# EAGLE design EspDetElet (EAGLE 6.4)
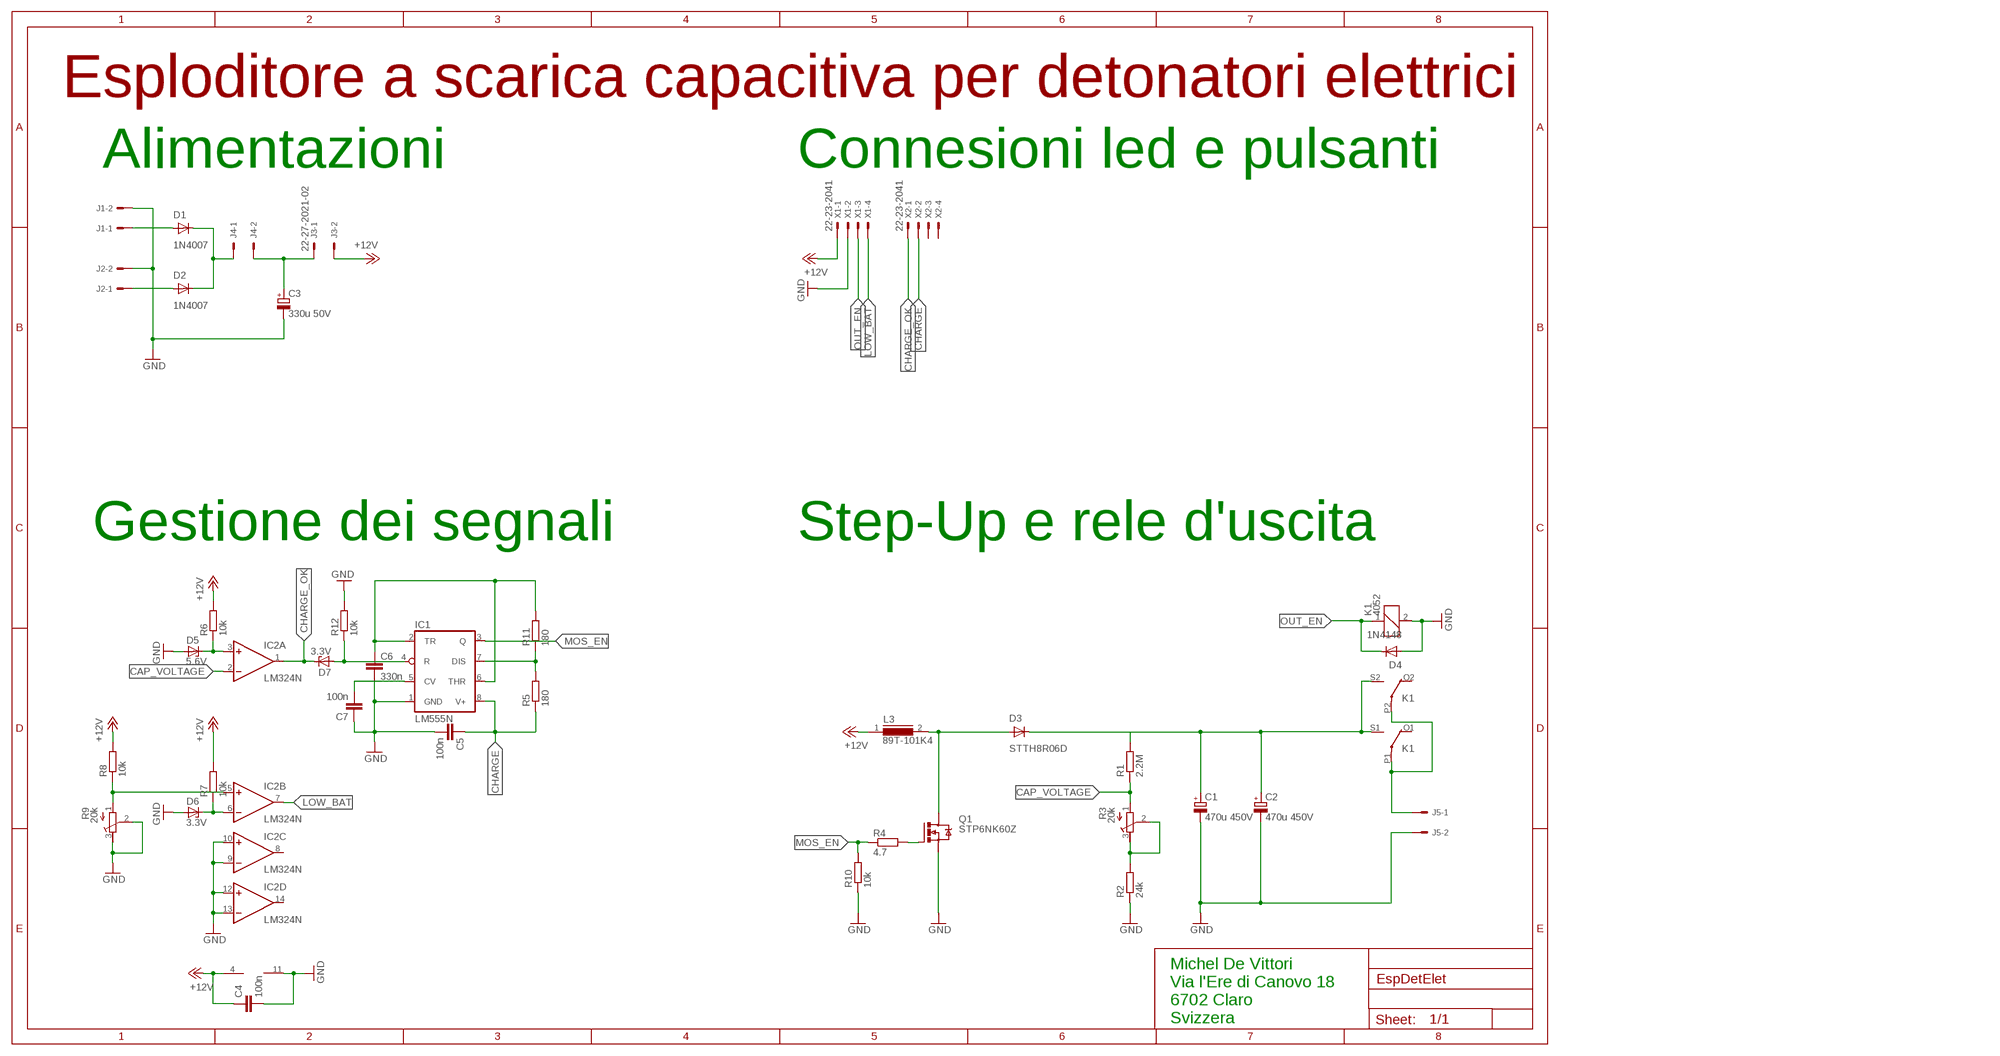
[diagram p0: schematic, sheet 1]

## Parts
C1  470u 450V  CPOL-EUE10-30  [EB30D]
C2  470u 450V  CPOL-EUE10-30  [EB30D]
C3  330u 50V  CPOL-EUE5-10.5  [E5-10,5]
C4  100n  C-EU025-025X050  [C025-025X050]
C5  100n  C-EU025-025X050  [C025-025X050]
C6  330n  C-EU050-030X075  [C050-030X075]
C7  100n  C-EU025-025X050  [C025-025X050]
D1  1N4007  1N4004  [DO41-10]
D2  1N4007  1N4004  [DO41-10]
D3  STTH8R06D  BYT08P  [TO220ACS]
D4  1N4148  1N4148DO35-7  [DO35-7]
D5  5.6V  ZENER-DIODEZD-7.5  [ZDIO-7.5]
D6  3.3V  ZENER-DIODEZD-7.5  [ZDIO-7.5]
D7  3.3V  ZENER-DIODEZD-7.5  [ZDIO-7.5]
IC1  LM555N  [DIL08]
IC2  LM324N  [DIL14]
J1  KK-156-2  [KK-156-2]
J2  KK-156-2  [KK-156-2]
J3  22-27-2021-02  [6410-02]
J4  KK-156-2  [KK-156-2]
J5  KK-156-2  [KK-156-2]
K1  4052  [F4052]
L3  89T-101K4  SFT1030  [SFT1030]
Q1  STP6NK60Z  STP5NA50  [TO220BV]
R1  2.2M  R-EU_0207/10  [0207/10]
R2  24k  R-EU_0207/10  [0207/10]
R3  20k  R-TRIMM64W  [RTRIM64W]
R4  4.7  R-EU_0207/10  [0207/10]
R5  180  R-EU_0207/10  [0207/10]
R6  10k  R-EU_0207/10  [0207/10]
R7  10k  R-EU_0207/10  [0207/10]
R8  10k  R-EU_0207/10  [0207/10]
R9  20k  R-TRIMM64W  [RTRIM64W]
R10  10k  R-EU_0207/10  [0207/10]
R11  180  R-EU_0207/10  [0207/10]
R12  10k  R-EU_0207/10  [0207/10]
X1  22-23-2041  [22-23-2041]
X2  22-23-2041  [22-23-2041]

## Nets
+12V: C4.1 IC2.4(P:V+) J3.2 L3.1 R6.2 R7.2 R8.2 X1.1
CAP_VOLTAGE: IC2.2(A:-IN) R1.1 R3.1(E)
CHARGE: C5.1 IC1.8(V+) R5.1 X2.2
CHARGE_OK: D7.C IC2.1(A:OUT) X2.1
GND: C1.- C2.- C3.- C4.2 C5.2 C6.2 C7.1 D4.A D5.A D6.A IC1.1(GND) IC2.9(C:-IN) IC2.10(C:+IN) IC2.11(P:V-) IC2.12(D:+IN) IC2.13(D:-IN) J1.2 J2.2 J5.2 K1.2 Q1.S R2.1 R9.2(S) R9.3(A) R10.1 R12.2 X1.2
LOW_BAT: IC2.7(B:OUT) X1.4
MOS_EN: IC1.3(Q) R4.1 R10.2
N$1: C1.+ C2.+ D3.C K1.S1(2:S) K1.S2(3:S) R1.2
N$2: D1.A J1.1
N$3: D2.A J2.1
N$4: D1.C D2.C J4.1
N$5: D3.A L3.2 Q1.D
N$6: R2.2 R3.2(S) R3.3(A)
N$7: C3.+ J3.1 J4.2
N$8: Q1.G R4.2
N$9: IC1.7(DIS) R5.2 R11.1
N$10: C6.1 IC1.2(TR) IC1.6(THR) R11.2
N$11: C7.2 IC1.5(CV)
N$12: D5.C IC2.3(A:+IN) R6.1
N$13: D7.A IC1.4(R) R12.1
N$14: J5.1 K1.P1(2:P) K1.P2(3:P)
N$15: D6.C IC2.6(B:-IN) R7.1
N$16: IC2.5(B:+IN) R8.1 R9.1(E)
OUT_EN: D4.C K1.1 X1.3
Unconnected: IC2.8(C:OUT) IC2.14(D:OUT) K1.O1(2:O) K1.O2(3:O) X2.3 X2.4

## Notes on the sheet
- Esploditore a scarica capacitiva per detonatori elettrici
- Alimentazioni | Connesioni led e pulsanti
- Gestione dei segnali | Step-Up e rele d'uscita
- Michel De Vittori
  Via l'Ere di Canovo 18
  6702 Claro
  Svizzera

## Library data of the parts
C1-C3 = resistor:CPOL-EU: POLARIZED CAPACITOR, European symbol
C4-C7 = resistor:C-EU: CAPACITOR, European symbol
D1 D2 = diode:1N4004: DIODE general purpose rectifier, 1 A
D3 = diode:BYT08P: DIODE ultra fast
D4 = diode:1N4148: DIODE high speed (Philips)
D5-D7 = diode:ZENER-DIODE: Z-Diode
IC1 = linear:*555: TIMER
IC2 = linear:LM324: OP AMP
J1 J2 J4 J5 = con-molex:KK-156-2: KK 156 HEADER Source: http://www.molex.com/pdm_docs/sd/026604100_sd.pdf; OC_FARNELL: unknown; OC_NEWARK: unknown
J3 = con-molex:22-?-02: CONNECTOR wire to board 2.54 mm (.1 inch) pitch header; OC_FARNELL: unknown; OC_NEWARK: unknown
K1 = relay:4052: RELAY 2 x switch, Finder; OC_FARNELL: unknown; OC_NEWARK: unknown
L3 = inductors:SFT1030: INDUCTOR
Q1 = transistor-power:STP5NA50: N-CHANNEL MOS FET
R1 R2 R4-R8 R10-R12 = resistor:R-EU_: RESISTOR, European symbol
R3 R9 = resistor:R-TRIMM: Trimm resistor
X1 X2 = con-molex:22-23-2041: .100" (2.54mm) Center Header - 4 Pin; MF: MOLEX; MPN: 22-23-2041; OC_FARNELL: 1462920; OC_NEWARK: 38C0355

## Board
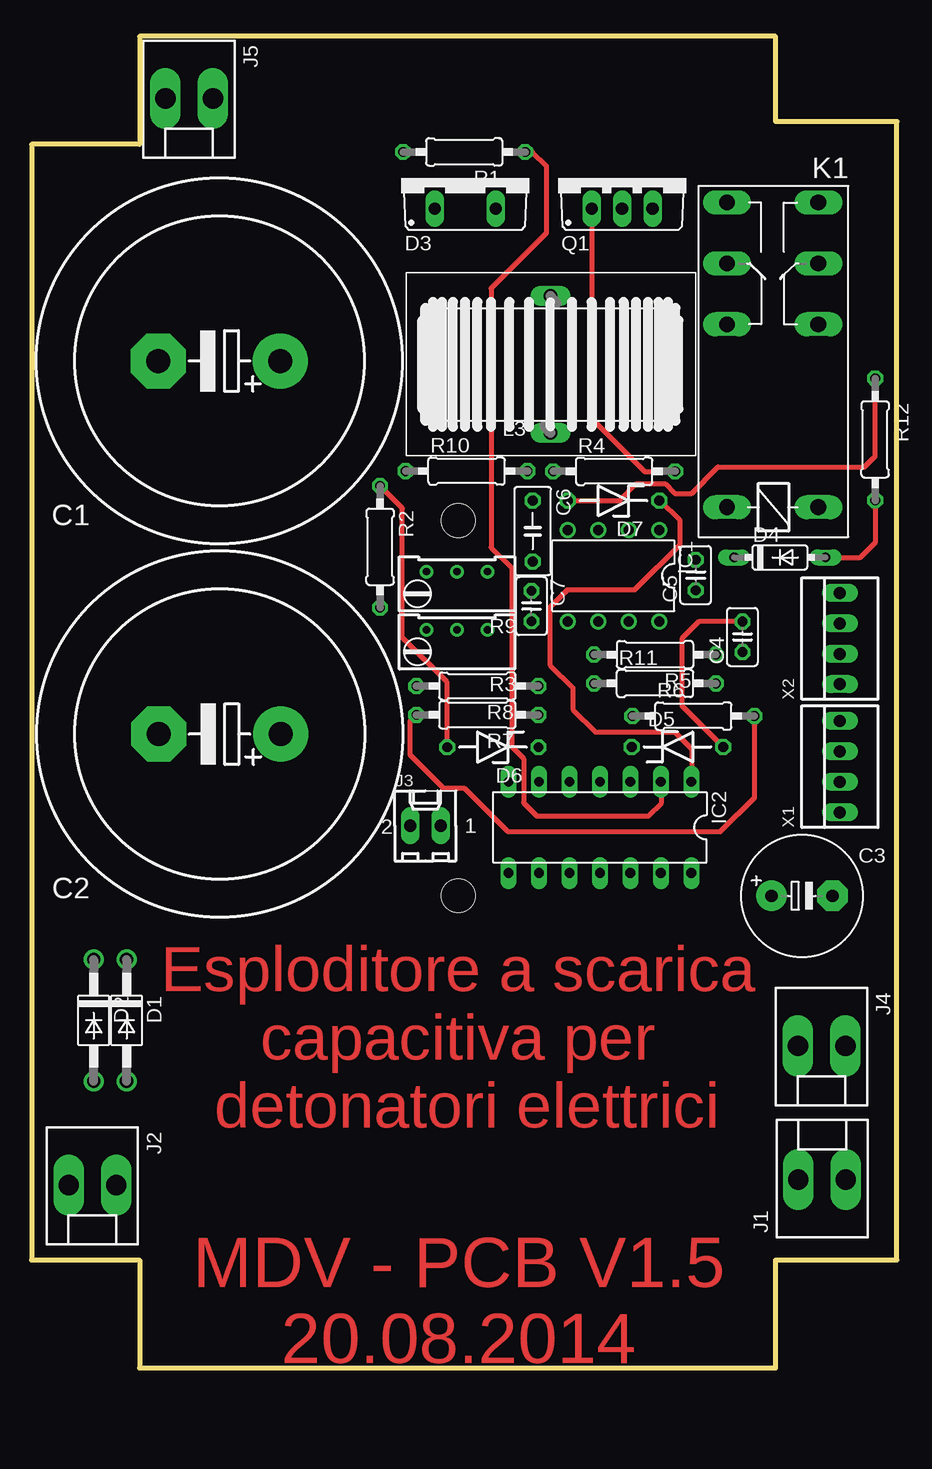
[diagram p1: board, top side]
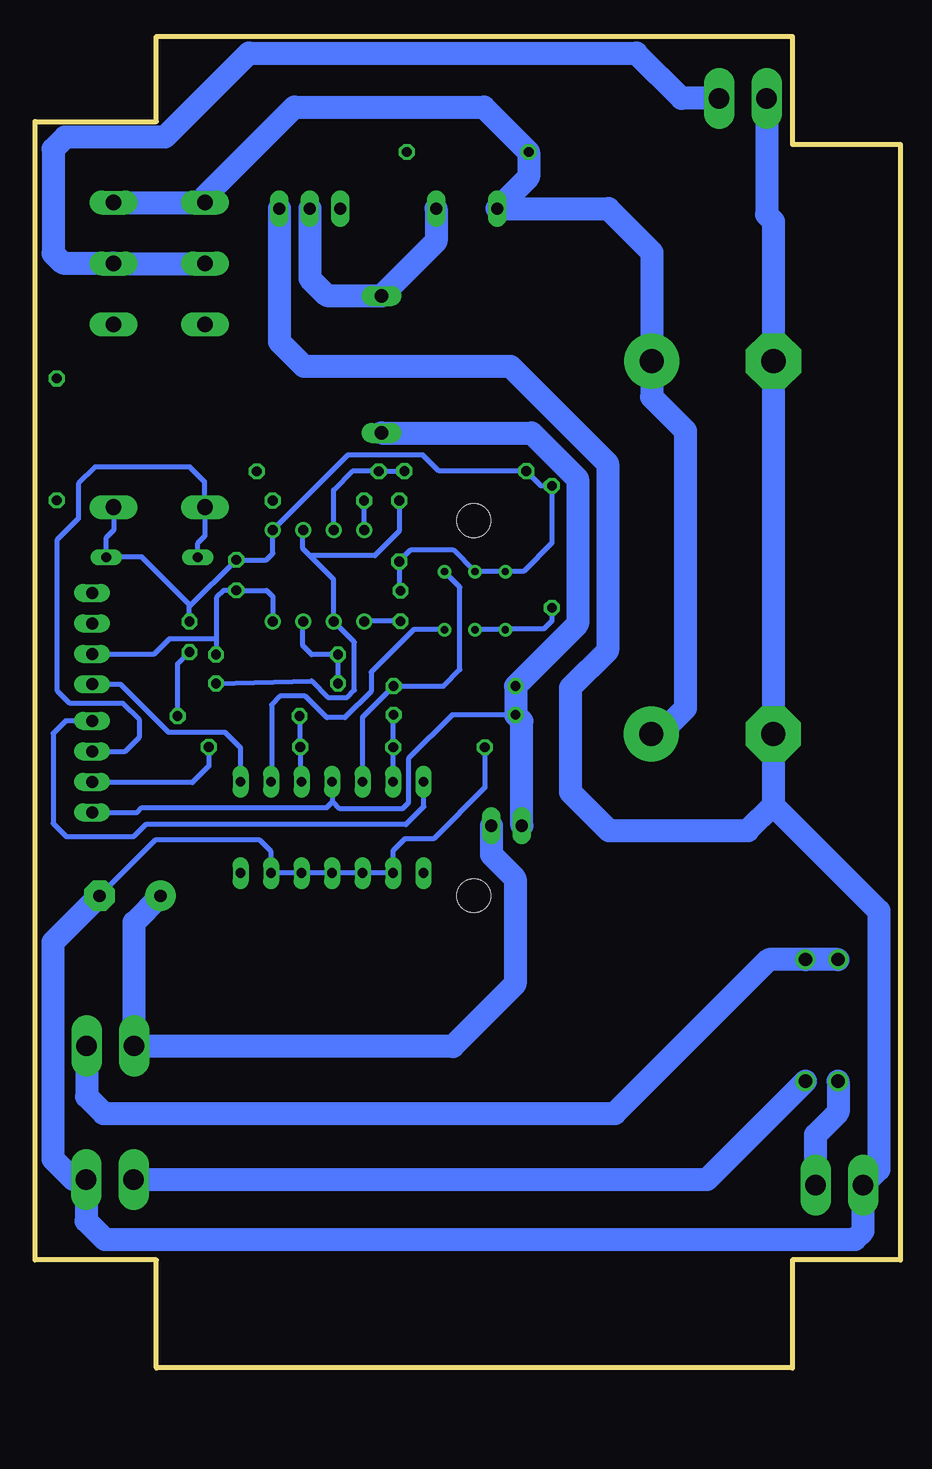
[diagram p2: board, bottom side, seen from below]

Size 72.1 x 111 mm. Coordinates in mm from the lower left corner, seen from the top.
Outline: 9,102 0,102 0,9 9,9 9,0 62,0 62,9 72.1,9 72.1,103.9 62,103.9 62,111 9,111 9,102
Copper layers (1*16): Top 0.035mm / dielectric 1.5mm / Bottom 0.035mm
Design rules "default": minimum track width 10mil, minimum drill 24mil, track to track 8mil, track to pad 8mil, pad to pad 8mil, via to via 8mil, smd to smd 8mil, copper to edge 40mil, drill to drill 8mil, minimum pad ring 10mil, minimum via ring 8mil, stop-mask expansion 4mil, vias tented up to drill 0mil, thermal gap 10mil
Holes 2.8 mm at 35.56,39.37 35.56,70.63
vRestrict: area 11.2,0 to 59.7,17.5; area 11.2,17.8 to 59.7,35.3

### Footprints (pad centres in the part's own frame; a part is rotated, then mirrored left to right if it is on the bottom)
EB30D = drill 2.007 pad 4.597: + -5.08,0 | drill 2.007 pad 4.597 octagon: - 5.08,0
E5-10,5 = drill 1.016 pad 2.54: + -2.54,0 | drill 1.016 pad 2.54 octagon: - 2.54,0
C025-025X050 = drill 0.813 octagon: 1 -1.27,0; 2 1.27,0
C050-030X075 = drill 0.813 octagon: 1 -2.54,0; 2 2.54,0
DO41-10 = drill 1.118: A 5.08,0; C -5.08,0
TO220ACS = drill 1.016 long: A 2.54,-2.54; C -2.54,-2.54
DO35-7 = drill 0.813 long: A 3.81,0; C -3.81,0
ZDIO-7.5 = drill 0.813 octagon: A 3.81,0; C -3.81,0
DIL08 = drill 0.813 pad 1.27: 1 -3.81,-3.81; 2 -1.27,-3.81; 3 1.27,-3.81; 4 3.81,-3.81; 5 3.81,3.81; 6 1.27,3.81; 7 -1.27,3.81; 8 -3.81,3.81
DIL14 = drill 0.813 long: 1 -7.62,-3.81; 2 -5.08,-3.81; 3 -2.54,-3.81; 4 0,-3.81; 5 2.54,-3.81; 6 5.08,-3.81; 7 7.62,-3.81; 8 7.62,3.81; 9 5.08,3.81; 10 2.54,3.81; 11 0,3.81; 12 -2.54,3.81; 13 -5.08,3.81; 14 -7.62,3.81
KK-156-2 = drill 1.7 pad 2.184 long: 1 -1.98,0; 2 1.98,0
6410-02 = drill 1.016 long: 1 1.27,0; 2 -1.27,0
F4052 = drill 1.321 long: 1 -3.81,3.81; 2 -3.81,-3.81; O1 11.43,-3.81; O2 11.43,3.81; P1 16.51,-3.81; P2 16.51,3.81; S1 21.59,-3.81; S2 21.59,3.81
SFT1030 = drill 1.118 long: 1 -5.75,-0.6; 2 5.68,-0.6
TO220BV = drill 1.016 long: D 0,-2.54; G -2.54,-2.54; S 2.54,-2.54
0207/10 = drill 0.813 octagon: 1 -5.08,0; 2 5.08,0
RTRIM64W = drill 0.61: 1 1.27,-2.54; 2 1.27,0; 3 1.27,2.54
22-23-2041 = drill 1 long: 1 -3.81,0; 2 -1.27,0; 3 1.27,0; 4 3.81,0

### Placement (x,y rotation side)
C1  15.65,83.94 180 top
C2  15.68,52.84 180 top
C3  64.2,39.35 0 top
C4  59.24,60.94 90 top
C5  55.34,66.09 90 top
C6  41.76,69.76 270 top
C7  41.66,63.51 270 top
D1  7.92,28.97 270 top
D2  5.18,28.97 270 top
D3  36.14,99.18 0 top
D4  62.36,67.57 0 top
D5  53.82,51.76 0 top
D6  38.44,51.74 180 top
D7  48.5,72.3 180 top
IC1  48.49,66.03 180 top
IC2  47.36,45.06 180 top
J1  65.87,15.71 0 top
J2  5.08,15.24 180 top
J3  32.82,45.19 0 top
J4  65.84,26.84 180 top
J5  13.13,105.83 180 top
K1  61.76,75.56 90 top
L3  42.64,83.68 90 top
Q1  49.21,99.18 0 top
R1  36.05,101.36 180 top
R2  29.04,68.45 270 top
R3  35.46,60.27 90 top
R4  48.55,74.74 0 top
R5  51.95,59.46 180 top
R6  55.15,54.34 0 top
R7  37.15,54.44 180 top
R8  37.15,56.84 180 top
R9  35.46,65.11 90 top
R10  36.25,74.76 0 top
R11  51.95,57.06 0 top
R12  70.3,77.4 270 top
X1  67.36,50.13 90 top
X2  67.36,60.8 90 top

### Tracks (layer width: path | path; a pad name or v marks a point on that pad's centre or on a via)
+12V
  Top 0.406: R6.2 60.23,47.53 57.4,44.7 39.7,44.7 36.1,48.3 34.35,48.3 31.55,51.1 31.55,53.92 R7.2
  Bottom 0.406: R6.2 60.23,58.68 C4.1 | X1.1 63.58,46.32 63.2,46.7 47.8,46.7 47.3,47.2 | 47.3,47.2 47.3,48.81 IC2.4 | R7.2 37.36,54.44 41,50.8 41,47.1 41.5,46.6 46.7,46.6 47.3,47.2
  Bottom 1.93: L3.1 30.73,77.93 26.9,74.1 26.9,62.01 R8.2 R7.2 31.55,53.92 J3.2
CAP_VOLTAGE
  Top 0.406: R1.1 41.74,101.36 42.9,100.2 42.9,94.6 38.3,90 38.3,68.4 40,66.7 40,51.8 41,50.8 41,47.1 42.1,46 51.4,46 52.5,47.1 52.5,48.81 IC2.2
  Bottom 0.406: R3.1 40.56,61.54 44.1,58 44.1,56.4 46.3,54.2 47.8,54.2 49.6,56 51.7,56 52.4,55.3 52.4,48.91 IC2.2
CHARGE
  Bottom 0.406: IC1.8 52.3,64.3 52.82,64.82 C5.1 56.38,64.82 57,64.2 57,60.9 | 57,60.9 57,59.93 R5.1 | X2.2 62.17,59.53 60.9,60.8 57.1,60.8 57,60.9
CHARGE_OK
  Top 0.406: IC2.1 55,48.89 55,51.6 53.6,53 47,53 45.1,54.9 45.1,56.7 43.2,58.6 43.2,63.4 44.68,64.88 50.28,64.88 54,68.6 54,70.7 52.4,72.3 D7.C
  Bottom 0.406: X2.1 64.99,56.99 61,53 56.3,53 55,51.7 55,48.89 IC2.1
GND
  Top 0.406: D5.A 54.2,55.2 54.2,60.8 55.61,62.21 C4.2 | D6.A 34.63,57.17 30.9,60.9 30.9,71.67 R2.1 | R12.2 70.3,68.8 69.07,67.57 D4.A
  Bottom 0.406: K1.2 65.57,69.83 66.17,69.23 D4.A 66.14,67.6 63.2,67.6 59.24,63.64 C4.2 59.24,63.46 C5.2 52.84,67.36 52.3,67.9 IC1.1 46.04,76.1 39.8,76.1 38.46,74.76 R10.1 29.94,73.53 R2.1 29.04,68.76 31.4,66.4 32.9,66.4 R9.3 R9.2 37.28,68.2 40.8,68.2 41.76,67.24 C6.2 41.76,64.88 C7.1 | D5.A 57.63,50.17 59,48.8 67.3,48.8 X1.2 | IC2.9 IC2.10 IC2.11 IC2.12 IC2.13 52.44,43.04 53.4,44 62.09,44 C3.- | D6.A 34.63,48.37 38.9,44.1 41.3,44.1 42.28,43.12 IC2.9 | 42.3,41.27 IC2.9
  Bottom 1.676: J1.2 68.91,15.71
  Bottom 1.93: J5.2 11.15,96.15 10.57,95.57 C1.- 10.57,52.84 C2.- 10.6,46.9 | 10.6,46.9 1.8,38.1 1.8,16.54 J2.2 3.1,11.4 3.8,10.7 66.3,10.7 67.85,12.25 J1.2 | Q1.S 51.75,85.55 49.7,83.5 32.5,83.5 24.4,75.4 24.4,59.8 27.5,56.7 27.5,48 24.3,44.8 12.7,44.8 10.6,46.9 | 68.91,15.71 70.6,17.4 70.6,35.49 C3.-
LOW_BAT
  Bottom 0.406: X1.4 69.56,53.94 70.6,52.9 70.6,45.4 69.5,44.3 63.9,44.3 62.9,45.3 41.2,45.3 39.7,46.8 39.7,48.83 IC2.7
MOS_EN
  Bottom 0.406: R10.2 41.35,74.74 R4.1 45.66,74.74 47.22,73.18 IC1.3
N$1
  Bottom 1.93: C2.+ 20.06,52.84 17.9,55 17.9,78.1 19.8,80 20.5,80.7 20.73,80.93 C1.+ | 20.7,83.91 C1.+ | C1.+ 20.7,83.97 20.7,93 24.34,96.64 D3.C 30.97,99.27 R1.2 34.71,105.1 50.5,105.1 57.95,97.65 K1.S2 K1.S1
N$2
  Bottom 1.93: J1.1 16.1,15.71 D1.A
N$3
  Bottom 1.93: D2.A 5.18,21.32 7.06,19.44 J2.1
N$4
  Bottom 1.93: D2.C D1.C 10.95,34.05 23.8,21.2 66.4,21.2 67.82,22.62 J4.1
N$5
  Bottom 1.93: D3.A 38.68,93.92 L3.2 43.28,89.4 47.8,89.4 49.21,90.81 Q1.D
N$6
  Bottom 0.406: R2.2 29.04,62.26 29.7,61.6 32.86,61.6 R3.3 R3.2
N$7
  Bottom 1.676: 63.82,26.8 J4.2
  Bottom 1.93: J4.2 63.86,37.15 C3.+ | 63.82,26.8 37.3,26.8 32.1,32 32.1,40.8 34.09,42.79 J3.1
N$8
  Top 0.406: Q1.G 46.67,79.13 51.1,74.7 53.59,74.7 R4.2
N$9
  Bottom 0.406: 46.77,57.36 R11.1 R5.2 49.06,59.46 49.8,60.2 49.8,62.18 IC1.7
N$10
  Bottom 0.406: 49.2,67.7 43.8,67.7 41.76,69.74 C6.1 | 49.2,67.7 49.8,68.3 49.8,69.8 IC1.2 | 49.2,67.7 47.22,65.72 IC1.6 45.5,60.5 45.5,56.5 46.1,55.9 47.7,55.9 49.06,57.26 R11.2
N$11
  Bottom 0.406: C7.2 44.66,62.24 IC1.5
N$12
  Bottom 0.406: R6.1 50.07,51.82 D5.C 50.01,48.98 IC2.3
N$13
  Top 0.406: D7.A 49,72.3 50.4,73.7 52.8,73.7 53.6,72.9 55,72.9 57.2,75.1 69.4,75.1 70.3,76 R12.1
  Bottom 0.406: IC1.4 D7.A
N$14
  Bottom 1.93: J5.1 18.23,105.83 22,109.6 54.3,109.6 61.3,102.6 69.6,102.6 70.6,101.6 70.6,92.9 69.8,92.1 65.6,92.1 K1.P1 K1.P2
N$15
  Bottom 0.406: IC2.6 42.28,51.71 D6.C 42.25,54.42 R7.1
N$16
  Bottom 0.406: IC2.5 44.82,54.25 R8.1 38.06,56.84 36.7,58.2 36.7,65.08 R9.1
OUT_EN
  Bottom 0.406: D4.C 58.55,68.75 57.95,69.35 K1.1 58,71.8 58,73.9 59.2,75.1 67.1,75.1 68.5,73.7 68.5,70.8 70.3,69 70.3,56.5 70.2,56.4 69.2,55.4 64.8,55.4 63.4,54 63.4,52.6 64.6,51.4 X1.3

### Text on the board
Top: Esploditore a scarica / capacitiva per / detonatori elettrici | MDV - PCB V1.5 / 20.08.2014